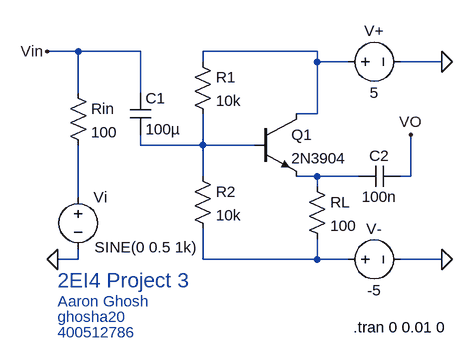
[diagram p0: schematic Project 3.asc]
Project 3.asc, the LTspice schematic file:
Version 4
SHEET 1 880 680
WIRE -288 -16 -336 -16
WIRE -192 -16 -288 -16
WIRE 80 -16 -96 -16
WIRE -96 0 -96 -16
WIRE 80 0 80 -16
WIRE 128 0 80 0
WIRE 272 0 208 0
WIRE -288 48 -288 -16
WIRE -192 48 -192 -16
WIRE 80 80 80 0
WIRE 80 80 48 80
WIRE -192 128 -192 112
WIRE -96 128 -96 80
WIRE -96 128 -192 128
WIRE -16 128 -96 128
WIRE -96 176 -96 128
WIRE 80 176 48 176
WIRE 144 176 80 176
WIRE 224 176 224 112
WIRE 224 176 208 176
WIRE 80 192 80 176
WIRE -288 208 -288 128
WIRE -288 304 -288 288
WIRE -288 304 -320 304
WIRE -96 304 -96 256
WIRE 80 304 80 272
WIRE 80 304 -96 304
WIRE 128 304 80 304
WIRE 272 304 208 304
FLAG -320 304 0
FLAG -336 -16 Vin
FLAG 272 0 0
FLAG 224 112 VO
FLAG 272 304 0
SYMBOL voltage -288 192 R0
WINDOW 3 25 93 Left 2
WINDOW 123 0 0 Left 0
WINDOW 39 0 0 Left 0
SYMATTR Value SINE(0 0.5 1k)
SYMATTR InstName Vi
SYMBOL res -304 32 R0
SYMATTR InstName Rin
SYMATTR Value 100
SYMBOL cap -208 48 R0
SYMATTR InstName C1
SYMATTR Value 100µ
SYMBOL res -112 -16 R0
SYMATTR InstName R1
SYMATTR Value 10k
SYMBOL res -112 160 R0
SYMATTR InstName R2
SYMATTR Value 10k
SYMBOL npn -16 80 R0
SYMATTR InstName Q1
SYMATTR Value 2N3904
SYMBOL voltage 112 0 R270
WINDOW 0 32 56 VTop 2
WINDOW 3 -32 56 VBottom 2
SYMATTR InstName V+
SYMATTR Value 5
SYMBOL cap 208 160 R90
WINDOW 0 0 32 VBottom 2
WINDOW 3 32 32 VTop 2
SYMATTR InstName C2
SYMATTR Value 100n
SYMBOL res 64 176 R0
SYMATTR InstName RL
SYMATTR Value 100
SYMBOL voltage 112 304 R270
WINDOW 0 32 56 VTop 2
WINDOW 3 -32 56 VBottom 2
SYMATTR InstName V-
SYMATTR Value -5
TEXT -320 336 Left 3 ;2EI4 Project 3
TEXT -320 368 Left 2 ;Aaron Ghosh
TEXT -320 392 Left 2 ;ghosha20
TEXT -320 416 Left 2 ;400512786
TEXT 136 408 Left 2 !.tran 0 0.01 0

The netlist it stands for:
* Project 3.asc
Vi N004 0 SINE(0 0.5 1k)
Rin Vin N004 100
C1 Vin N002 100µ
R1 N001 N002 10k
R2 N002 N005 10k
Q1 N001 N002 N003 0 2N3904
V+ N001 0 5
C2 VO N003 100n
RL N003 N005 100
V- N005 0 -5
.model NPN NPN
.model PNP PNP
.lib standard.bjt
* 2EI4 Project 3
* Aaron Ghosh
* ghosha20
* 400512786
.tran 0 0.01 0
.backanno
.end